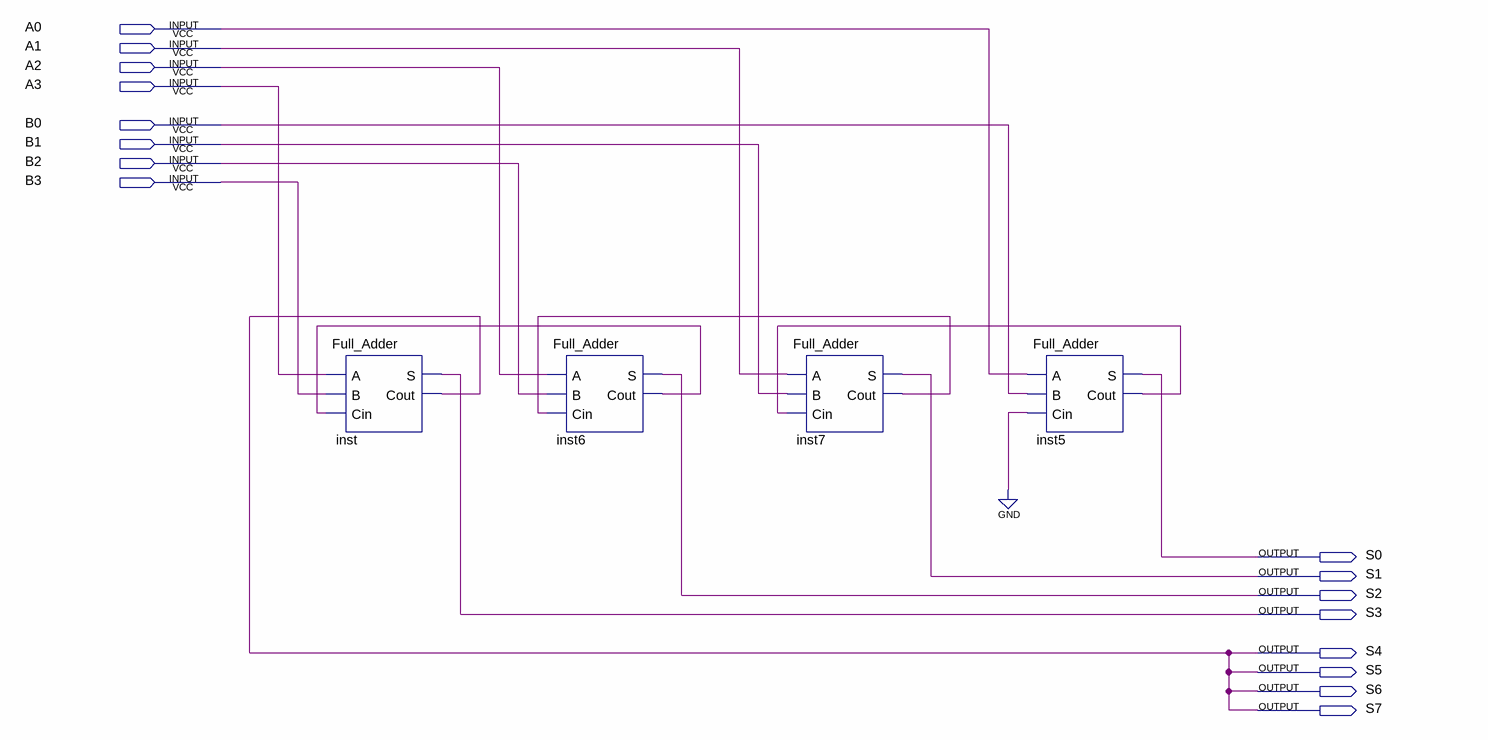
[diagram p0: schematic sheet]
// Quartus schematic Full_Adder_4_bits.bdf as structural Verilog: 4 symbols, 16 pins
module Full_Adder_4_bits (
  input  A0,
  input  A1,
  input  A2,
  input  A3,
  input  B0,
  input  B1,
  input  B2,
  input  B3,
  output S0,
  output S1,
  output S2,
  output S3,
  output S4,
  output S5,
  output S6,
  output S7
);

  wire inst5_cout, inst6_cout, inst7_cout;

  Full_Adder inst (.A(A3), .B(B3), .Cin(inst6_cout), .S(S3), .Cout(S4));
  Full_Adder inst6 (.A(A2), .B(B2), .Cin(inst7_cout), .S(S2), .Cout(inst6_cout));
  Full_Adder inst7 (.A(A1), .B(B1), .Cin(inst5_cout), .S(S1), .Cout(inst7_cout));
  Full_Adder inst5 (.A(A0), .B(B0), .Cin(1'b0), .S(S0), .Cout(inst5_cout));

  assign S5 = S4;
  assign S6 = S4;
  assign S7 = S4;
endmodule
